# EAGLE design main_PCA9685 (EAGLE 9.6.2)
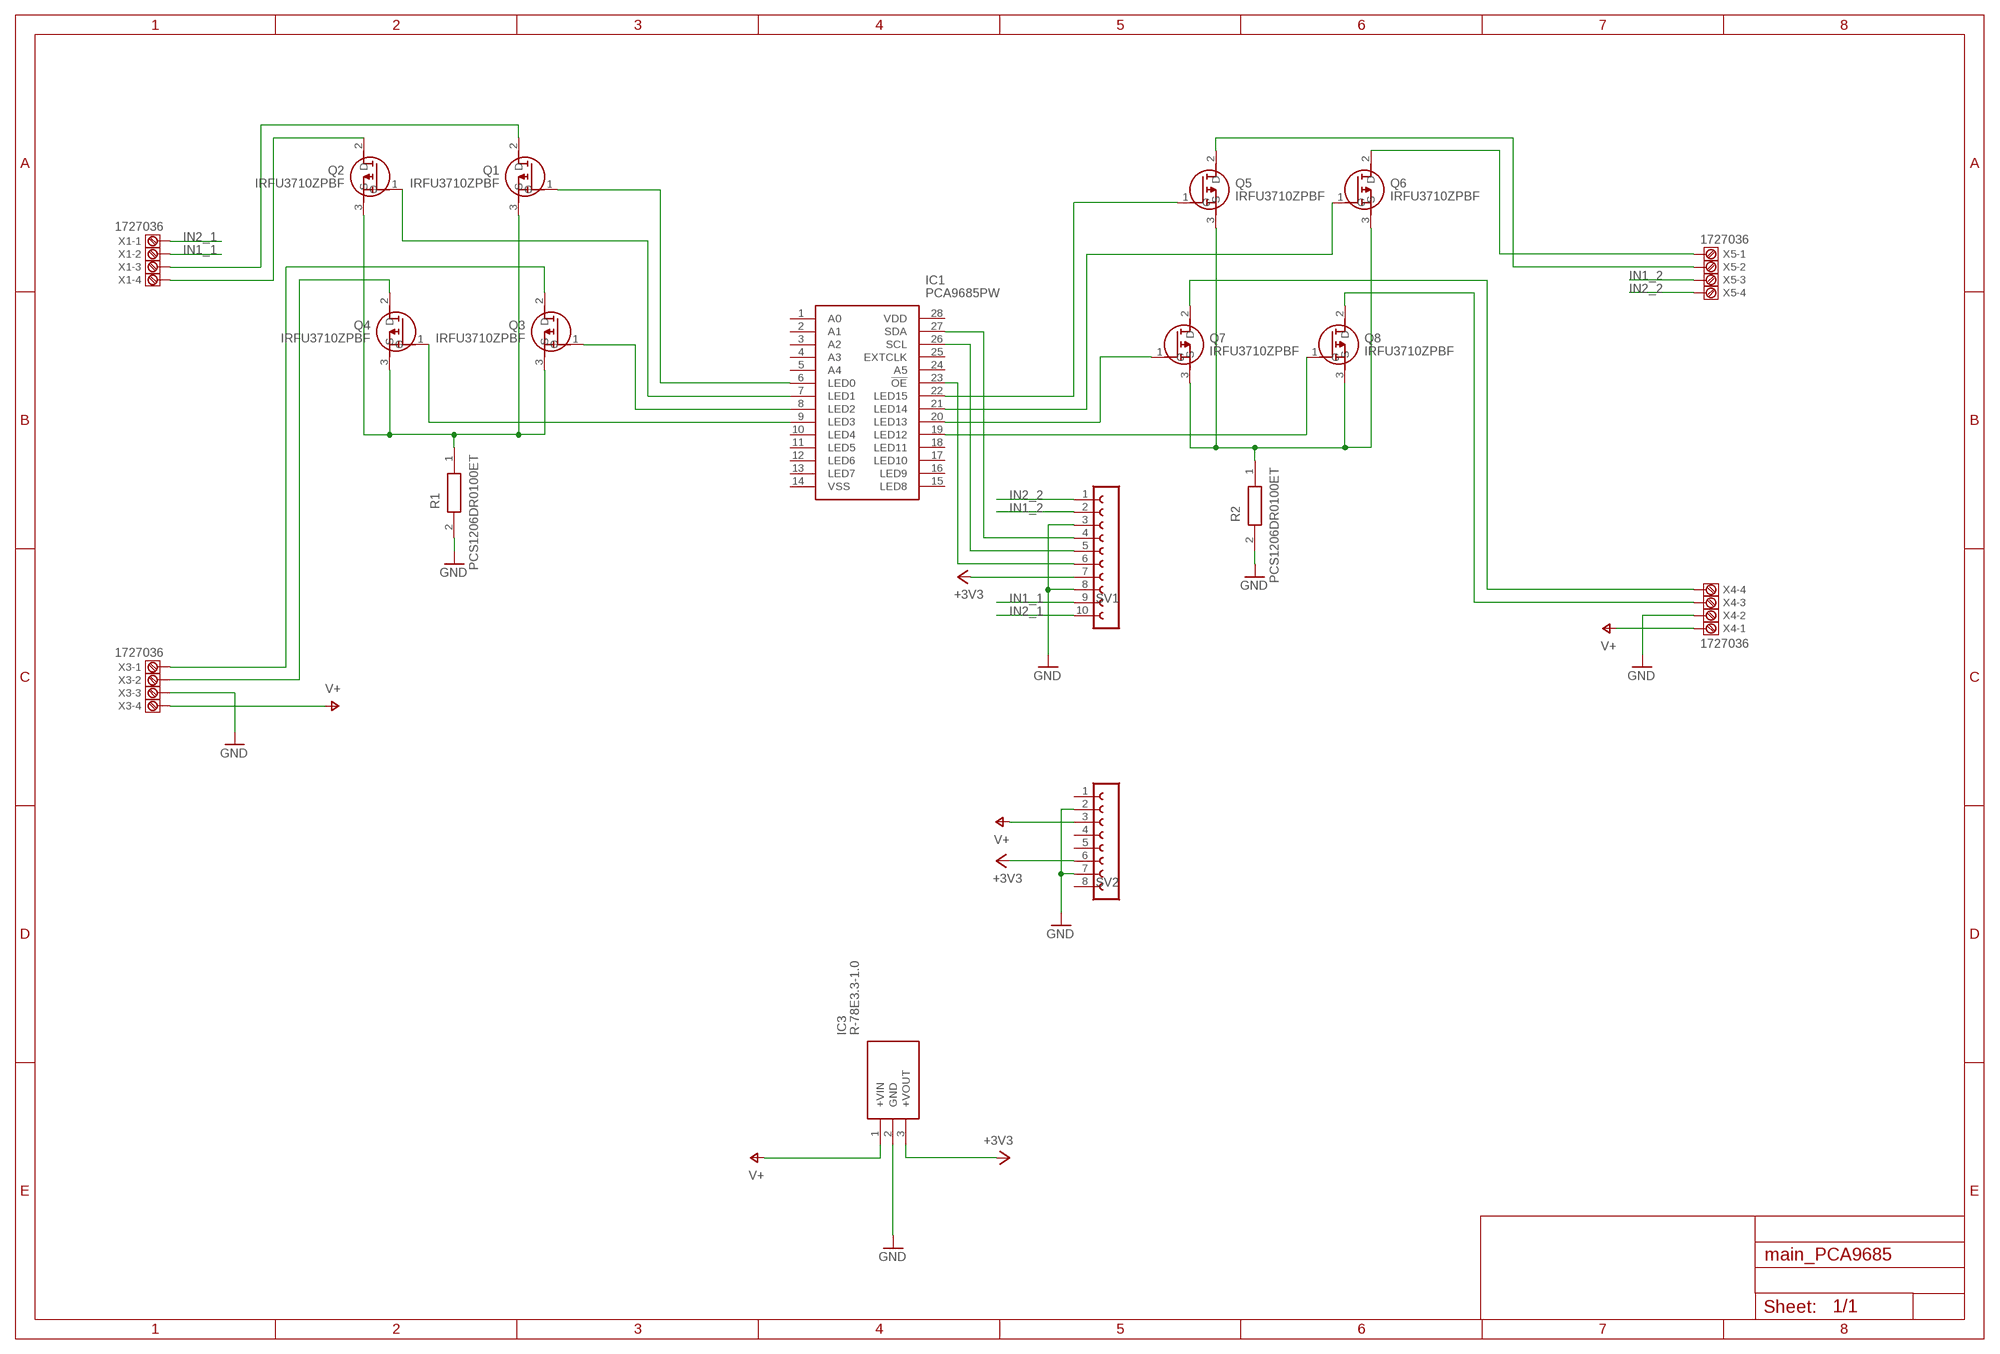
[diagram p0: schematic, sheet 1]

## Parts
IC1  PCA9685PW  [SOP65P640X110-28N]
IC3  R-78E3.3-1.0  [R78E3310]
Q1  IRFU3710ZPBF  [TO229P239X654X978-3P]
Q2  IRFU3710ZPBF  [TO229P239X654X978-3P]
Q3  IRFU3710ZPBF  [TO229P239X654X978-3P]
Q4  IRFU3710ZPBF  [TO229P239X654X978-3P]
Q5  IRFU3710ZPBF  [TO229P239X654X978-3P]
Q6  IRFU3710ZPBF  [TO229P239X654X978-3P]
Q7  IRFU3710ZPBF  [TO229P239X654X978-3P]
Q8  IRFU3710ZPBF  [TO229P239X654X978-3P]
R1  PCS1206DR0100ET  [RESC3216X68N]
R2  PCS1206DR0100ET  [RESC3216X68N]
SV1  FE10-1  [FE10]
SV2  FE08-1  [FE08]
X1  1727036  [1727036]
X3  1727036  [1727036]
X4  1727036  [1727036]
X5  1727036  [1727036]

## Nets
+3V3: IC3.3(+VOUT) SV1.7 SV2.6
GND: IC3.2(GND) R1.2 R2.2 SV1.3 SV1.8 SV2.2 SV2.7 X3.3 X4.2
IN1_1: SV1.9 X1.2
IN1_2: SV1.2 X5.3
IN2_1: SV1.10 X1.1
IN2_2: SV1.1 X5.4
N$1: IC1.8(LED2) Q3.1(G)
N$2: IC1.9(LED3) Q4.1(G)
N$3: IC1.7(LED1) Q2.1(G)
N$4: IC1.6(LED0) Q1.1(G)
N$5: Q4.2(D) X3.2
N$6: Q3.2(D) X3.1
N$7: Q2.2(D) X1.4
N$8: Q1.2(D) X1.3
N$9: IC1.27(SDA) SV1.4
N$10: Q1.3(S) Q2.3(S) Q3.3(S) Q4.3(S) R1.1
N$11: IC1.26(SCL) SV1.5
N$12: Q5.3(S) Q6.3(S) Q7.3(S) Q8.3(S) R2.1
N$13: Q8.2(D) X4.3
N$14: Q7.2(D) X4.4
N$15: Q6.2(D) X5.1
N$16: Q5.2(D) X5.2
N$17: IC1.19(LED12) Q8.1(G)
N$18: IC1.20(LED13) Q7.1(G)
N$19: IC1.21(LED14) Q6.1(G)
N$20: IC1.22(LED15) Q5.1(G)
N$25: IC1.23(!OE) SV1.6
V+: IC3.1(+VIN) SV2.3 X3.4 X4.1
Unconnected: IC1.1(A0) IC1.2(A1) IC1.3(A2) IC1.4(A3) IC1.5(A4) IC1.10(LED4) IC1.11(LED5) IC1.12(LED6) IC1.13(LED7) IC1.14(VSS) IC1.15(LED8) IC1.16(LED9) IC1.17(LED10) IC1.18(LED11) IC1.24(A5) IC1.25(EXTCLK) IC1.28(VDD) SV2.1 SV2.4 SV2.5 SV2.8

## Library data of the parts
IC1 = SamacSys_Parts:PCA9685PW: LED DRIVER, RGBA, 28-TSSOP Source: Datasheet <http://docs-asia.electrocomponents.com/webdocs/0f65/0900766b80f65101.pdf>; DESCRIPTION: LED DRIVER, RGBA, 28-TSSOP; HEIGHT: 1.1mm; MANUFACTURER_NAME: Nexperia; MANUFACTURER_PART_NUMBER: PCA9685PW; MOUSER_PART_NUMBER: N/A; MOUSER_PRICE-STOCK: https://www.mouser.com/Search/Refine.aspx?Keyword=N%2FA
IC3 = SamacSys_Parts:R-78E3.3-1.0: Recom DC-DC Switching Regulator, 7 28V dc Input, 3.3V Output, 1A Source: Datasheet <https://componentsearchengine.com/Datasheets/1/R-78E3.3-1.0.pdf>; ARROW_PART_NUMBER: R-78E3.3-1.0; ARROW_PRICE-STOCK: https://www.arrow.com/en/products/r-78e3.3-1.0/recom-power; DESCRIPTION: Recom DC-DC Switching Regulator, 7 28V dc Input, 3.3V Output, 1A; HEIGHT: 10.9mm; MANUFACTURER_NAME: RECOM Power; MANUFACTURER_PART_NUMBER: R-78E3.3-1.0; MOUSER_PART_NUMBER: 919-R-78E3.3-1.0; MOUSER_PRICE-STOCK: https://www.mouser.co.uk/ProductDetail/RECOM-Power/R-78E33-10/?qs=D0iH%252BVFiYPOgLjjtWWnV0Q%3D%3D
Q1-Q8 = SamacSys_Parts:IRFU3710ZPBF: MOSFET N-Channel 100V 56A HEXFET IPAK Infineon IRFU3710ZPBF N-channel MOSFET Transistor, 56 A, 100 V, 3-Pin IPAK Source: Datasheet <http://uk.rs-online.com/web/p/products/6887131>; DESCRIPTION: MOSFET N-Channel 100V 56A HEXFET IPAK Infineon IRFU3710ZPBF N-channel MOSFET Transistor, 56 A, 100 V, 3-Pin IPAK; HEIGHT: 2.39mm; MANUFACTURER_NAME: Infineon; MANUFACTURER_PART_NUMBER: IRFU3710ZPBF; MOUSER_PART_NUMBER: 942-IRFU3710ZPBF; MOUSER_PRICE-STOCK: https://www.mouser.co.uk/ProductDetail/Infineon-IR/IRFU3710ZPBF/?qs=9%252BKlkBgLFf3NyWsRABCVig%3D%3D
R1 R2 = SamacSys_Parts:PCS1206DR0100ET: Current Sense Resistors - SMD 1W 0.010 OHMS 0.5% Source: Datasheet <https://componentsearchengine.com//PCS1206DR0100ET.pdf>; DESCRIPTION: Current Sense Resistors - SMD 1W 0.010 OHMS 0.5%; HEIGHT: 0.684mm; MANUFACTURER_NAME: Ohmite; MANUFACTURER_PART_NUMBER: PCS1206DR0100ET; MOUSER_PART_NUMBER: 588-PCS1206DR0100ET; MOUSER_PRICE-STOCK: https://www.mouser.co.uk/ProductDetail/Ohmite/PCS1206DR0100ET/?qs=Zz7%252BYVVL6bH%2F2nwIEMOhrA%3D%3D
SV1 = con-lsta:FE10-1: FEMALE HEADER; OC_FARNELL: unknown; OC_NEWARK: unknown
SV2 = con-lsta:FE08-1: FEMALE HEADER; OC_FARNELL: unknown; OC_NEWARK: unknown
X1 X3-X5 = con-phoenix-3.81:1727036: MKDS 1/4-3,81 Source: http://eshop.phoenixcontact.de; MF: FARNELL; MPN: 1727036; OC_FARNELL: 3704592; OC_NEWARK: 71C4114

## Board
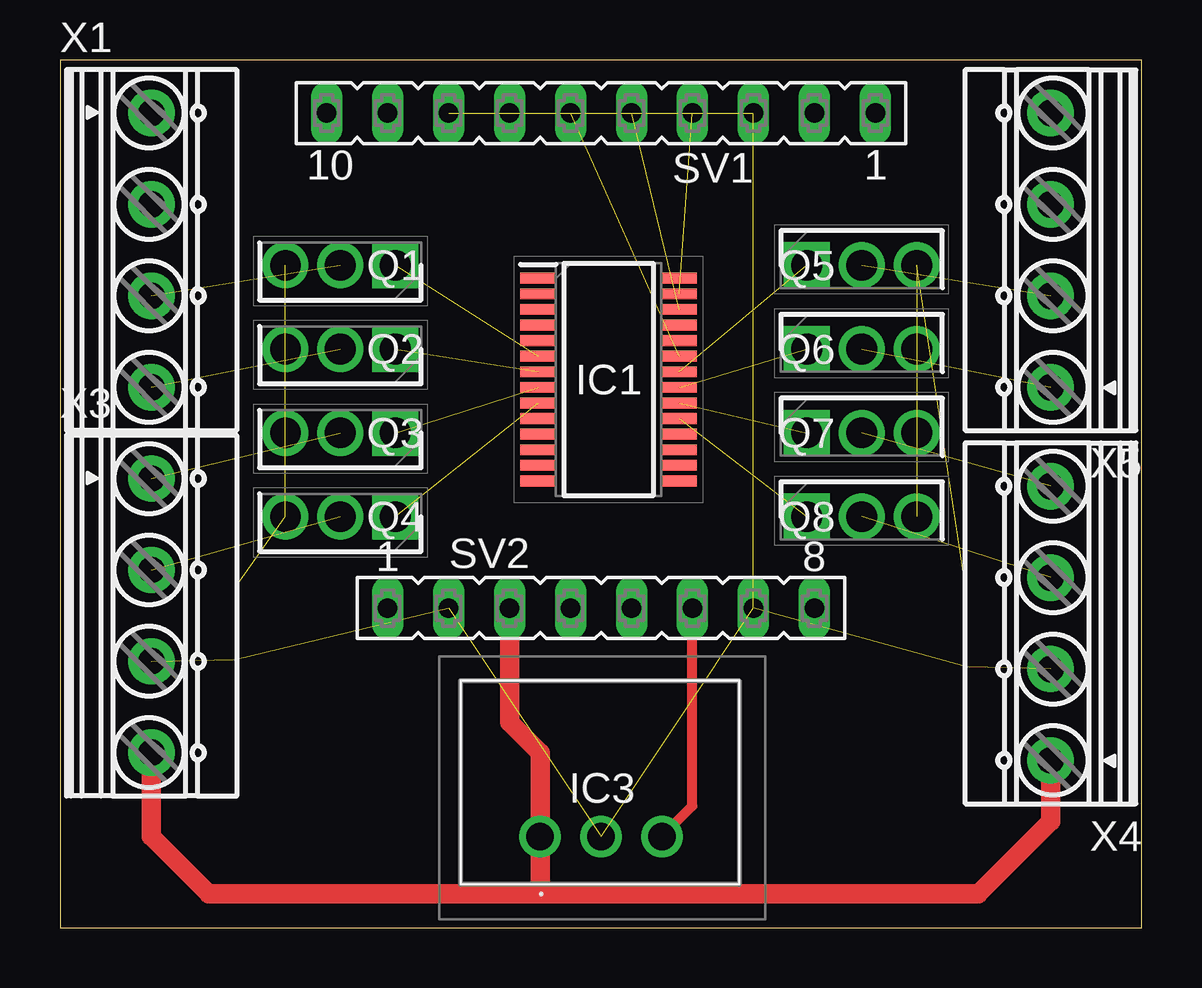
[diagram p1: board, top side]
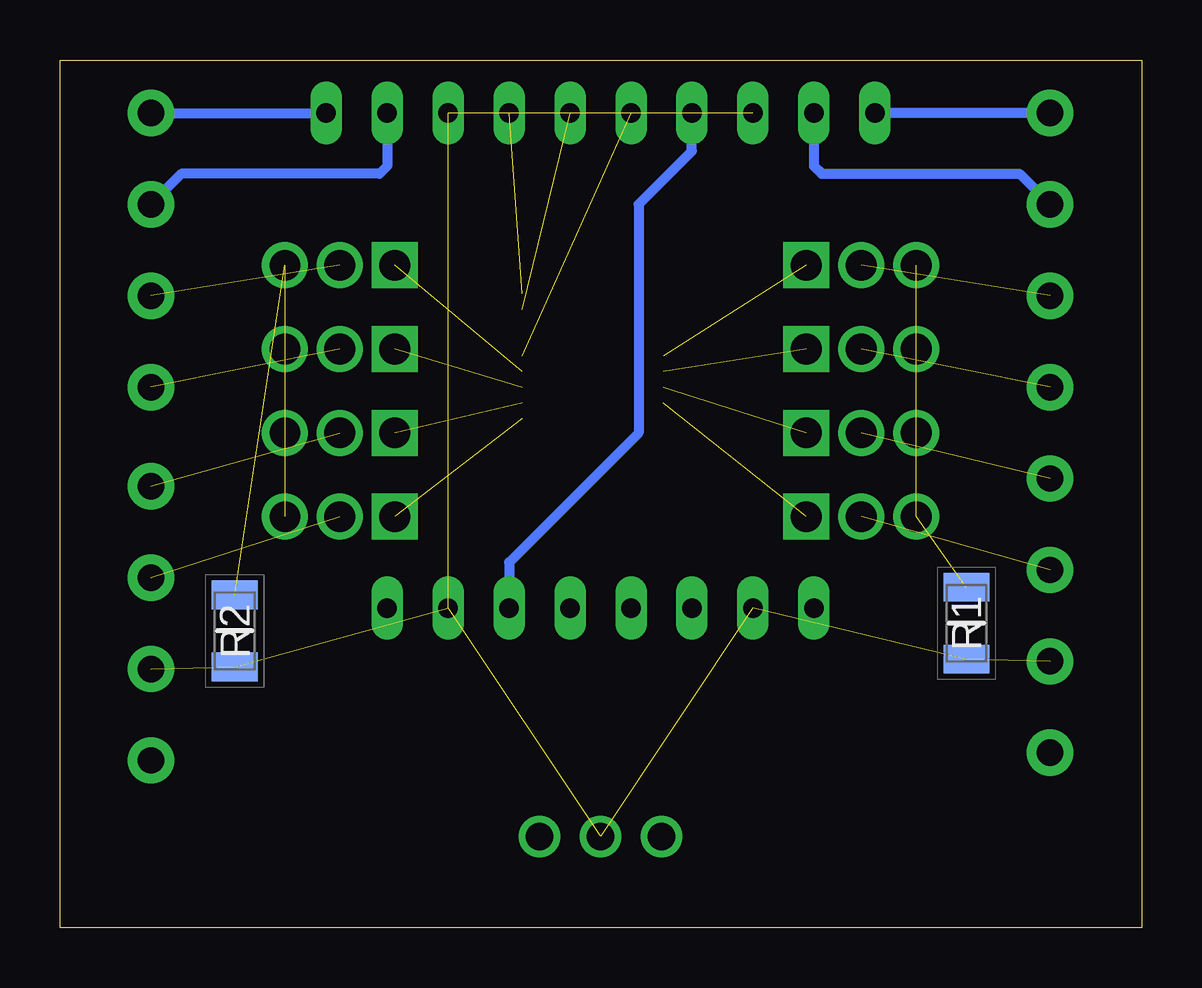
[diagram p2: board, bottom side, seen from below]

Size 45.06 x 36.18 mm. Coordinates in mm from the lower left corner, seen from the top.
Outline: 0,36.18 0,0 45.06,0 45.06,36.18 0,36.18
Copper layers (1*16): Top 0.035mm / dielectric 1.5mm / Bottom 0.035mm
Design rules "default": minimum track width 6mil, minimum drill 0.35mm, track to track 6mil, track to pad 6mil, pad to pad 6mil, via to via 6mil, smd to smd 6mil, copper to edge 40mil, drill to drill 6mil, minimum pad ring 10mil, minimum via ring 8mil, stop-mask expansion 4mil, vias tented up to drill 0mil, thermal gap 10mil

### Footprints (pad centres in the part's own frame; a part is rotated, then mirrored left to right if it is on the bottom)
SOP65P640X110-28N = smd 1.475 x 0.45: 1 -2.938,4.225; 2 -2.938,3.575; 3 -2.938,2.925; 4 -2.938,2.275; 5 -2.938,1.625; 6 -2.938,0.975; 7 -2.938,0.325; 8 -2.938,-0.325; 9 -2.938,-0.975; 10 -2.938,-1.625; 11 -2.938,-2.275; 12 -2.938,-2.925; 13 -2.938,-3.575; 14 -2.938,-4.225; 15 2.938,-4.225; 16 2.938,-3.575; 17 2.938,-2.925; 18 2.938,-2.275; 19 2.938,-1.625; 20 2.938,-0.975; 21 2.938,-0.325; 22 2.938,0.325; 23 2.938,0.975; 24 2.938,1.625; 25 2.938,2.275; 26 2.938,2.925; 27 2.938,3.575; 28 2.938,4.225
R78E3310 = drill 1.15 pad 1.725: 1 0,0; 2 2.54,0; 3 5.08,0
TO229P239X654X978-3P = drill 1.28 pad 1.92 square: 1 0,0 | drill 1.28 pad 1.92: 2 2.29,0; 3 4.58,0
RESC3216X68N = smd 1.2 x 1.9: 1 -1.5,0; 2 1.5,0
FE10 = drill 0.813 long: 1 -11.43,0; 2 -8.89,0; 3 -6.35,0; 4 -3.81,0; 5 -1.27,0; 6 1.27,0; 7 3.81,0; 8 6.35,0; 9 8.89,0; 10 11.43,0
FE08 = drill 0.813 long: 1 -8.89,0; 2 -6.35,0; 3 -3.81,0; 4 -1.27,0; 5 1.27,0; 6 3.81,0; 7 6.35,0; 8 8.89,0
1727036 = drill 1.1 pad 1.93: 1 -5.715,0; 2 -1.905,0; 3 1.905,0; 4 5.715,0

### Placement (x,y rotation side)
IC1  22.86,22.86 0 top
IC3  20,3.81 0 top
Q1  13.97,27.62 180 top
Q2  13.97,24.13 180 top
Q3  13.97,20.64 180 top
Q4  13.97,17.14 180 top
Q5  31.11,27.62 0 top
Q6  31.11,24.13 0 top
Q7  31.11,20.64 0 top
Q8  31.11,17.14 0 top
R1  7.3,12.7 270 bottom
R2  37.78,12.38 270 bottom
SV1  22.54,33.97 180 top
SV2  22.54,13.34 0 top
X1  3.81,28.26 270 top
X3  3.81,13.02 270 top
X4  41.27,12.7 90 top
X5  41.27,28.26 90 top

### Tracks (layer width: path | path; a pad name or v marks a point on that pad's centre or on a via)
+3V3
  Top 0.406: IC3.3 26.35,5.08 SV2.6
  Bottom 0.406: SV1.7 18.73,32.38 20.95,30.16 20.95,20.64 26.35,15.24 SV2.6
GND  (8 unrouted)
IN1_1
  Bottom 0.406: SV1.9 13.65,31.75 13.34,31.43 5.08,31.43 X1.2
IN1_2
  Bottom 0.406: SV1.2 31.43,31.75 31.75,31.43 40.01,31.43 X5.3
IN2_1
  Bottom 0.406: X1.1 SV1.10
IN2_2
  Bottom 0.406: X5.4 SV1.1
N$1  (1 unrouted)
N$2  (1 unrouted)
N$3  (1 unrouted)
N$4  (1 unrouted)
N$5  (1 unrouted)
N$6  (1 unrouted)
N$7  (1 unrouted)
N$8  (1 unrouted)
N$9  (1 unrouted)
N$10  (4 unrouted)
N$11  (1 unrouted)
N$12  (4 unrouted)
N$13  (1 unrouted)
N$14  (1 unrouted)
N$15  (1 unrouted)
N$16  (1 unrouted)
N$17  (1 unrouted)
N$18  (1 unrouted)
N$19  (1 unrouted)
N$20  (1 unrouted)
N$25  (1 unrouted)
V+
  Top 0.813: X3.4 3.81,3.81 6.2,1.42 20,1.42 | X4.1 41.27,4.45 38.25,1.42 20,1.42 | 20,1.42 IC3.1 20,7.3 18.73,8.57 SV2.3